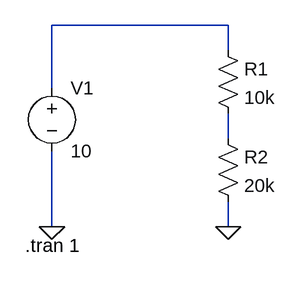
[diagram p0: schematic voltage-divider.asc]
voltage-divider.asc, the LTspice schematic file:
Version 4
SHEET 1 880 680
WIRE 224 48 0 48
WIRE 224 80 224 48
WIRE 0 128 0 48
WIRE 224 192 224 160
WIRE 0 304 0 208
WIRE 224 304 224 272
FLAG 0 304 0
FLAG 224 304 0
SYMBOL res 208 64 R0
SYMATTR InstName R1
SYMATTR Value 10k
SYMBOL res 208 176 R0
SYMATTR InstName R2
SYMATTR Value 20k
SYMBOL voltage 0 112 R0
WINDOW 123 0 0 Left 0
WINDOW 39 0 0 Left 0
SYMATTR InstName V1
SYMATTR Value 10
TEXT -34 328 Left 2 !.tran 1

The netlist it stands for:
* voltage-divider.asc
R1 N001 N002 10k
R2 N002 0 20k
V1 N001 0 10
.tran 1
.backanno
.end